# EAGLE design IRAMX-drv-v3.1 (EAGLE 7.2.0)
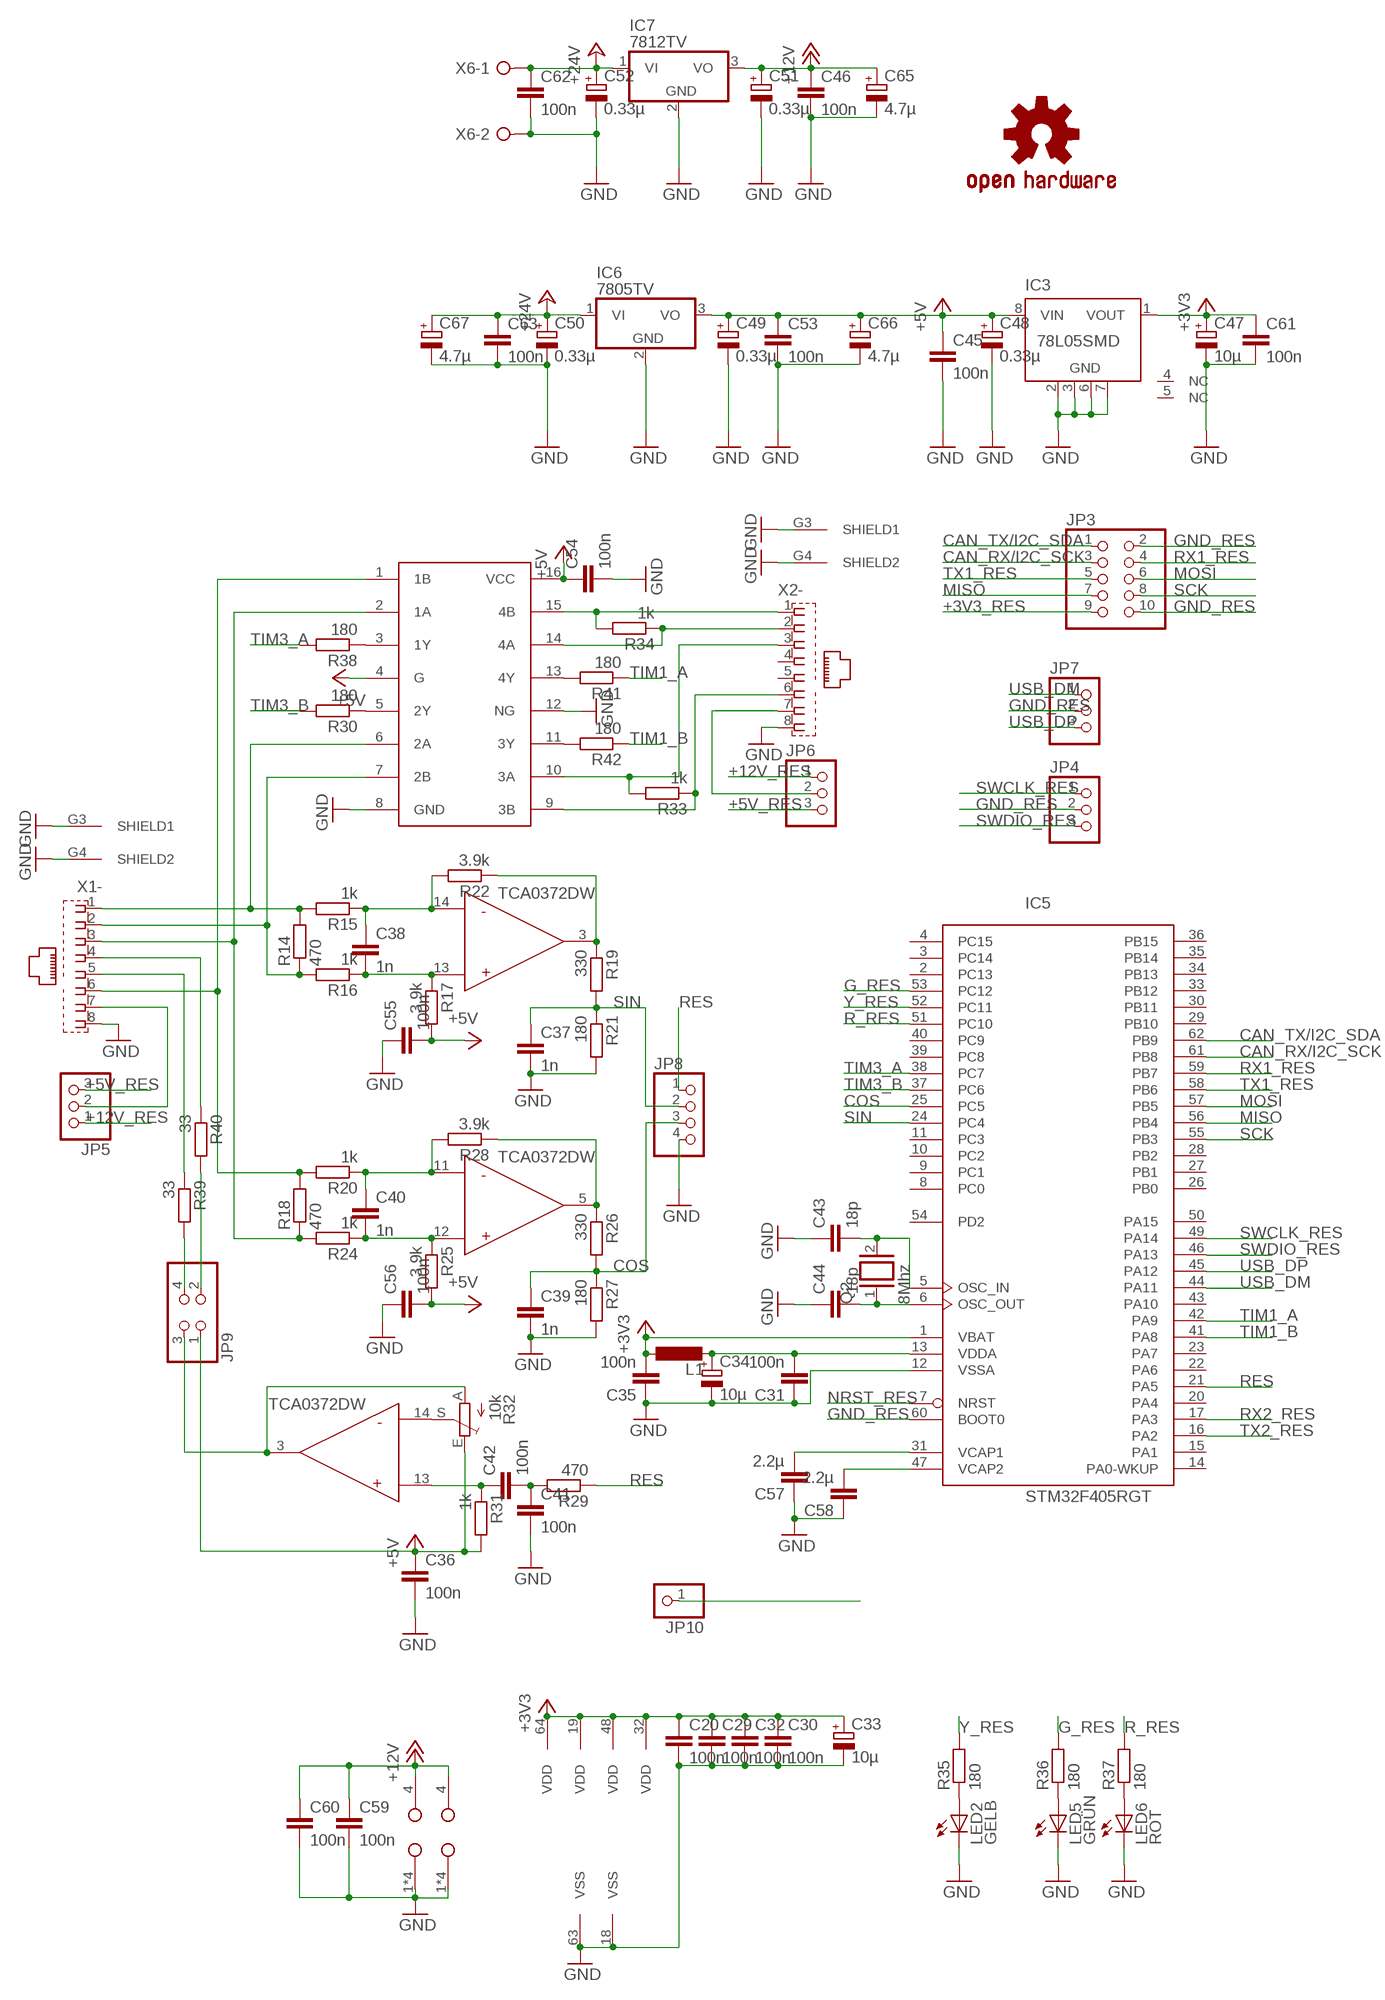
[diagram p0: schematic, sheet 1, part 1 of 2]
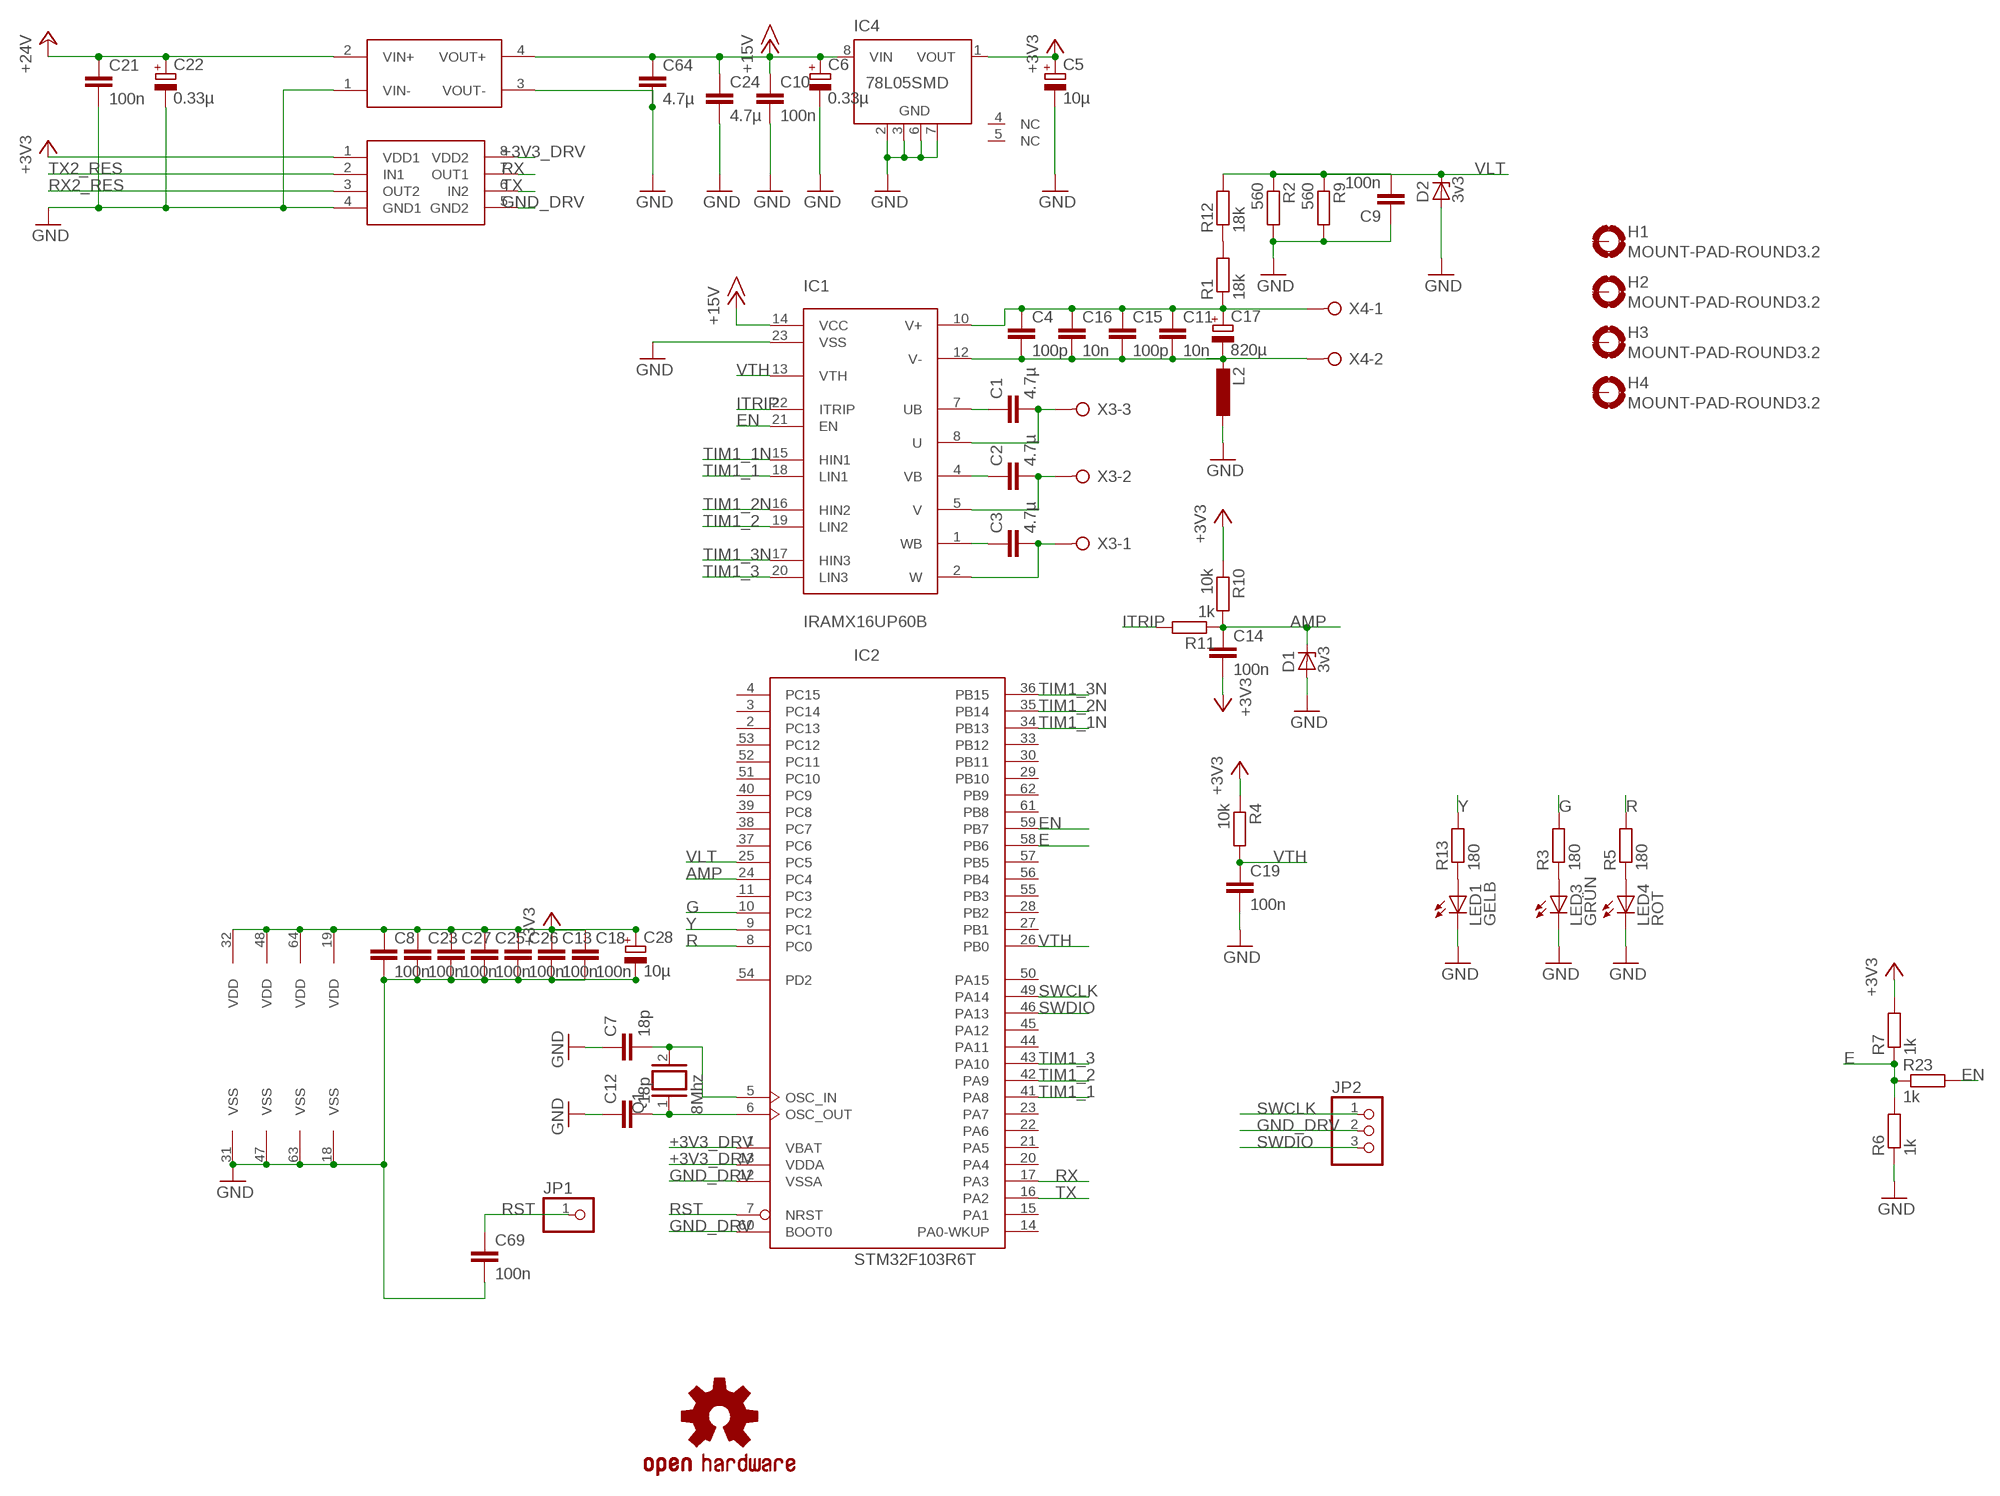
[diagram p1: schematic, sheet 1, part 2 of 2]

## Parts
C1  4.7µ  C-EUC0805K  [C0805K]
C2  4.7µ  C-EUC0805K  [C0805K]
C3  4.7µ  C-EUC0805K  [C0805K]
C4  100p  C-EUC1206K  [C1206K]
C5  10µ  CPOL-EUA/3216-18R  [A/3216-18R]
C6  0.33µ  CPOL-EUA/3216-18R  [A/3216-18R]
C7  18p  C-EUC0805  [C0805]
C8  100n  C-EUC0805K  [C0805K]
C9  100n  C-EUC0805K  [C0805K]
C10  100n  C-EUC0805K  [C0805K]
C11  10n  C-EUC0805K  [C0805K]
C12  18p  C-EUC0805  [C0805]
C13  100n  C-EUC0805K  [C0805K]
C14  100n  C-EUC0805K  [C0805K]
C15  100p  C-EUC1206K  [C1206K]
C16  10n  C-EUC0805K  [C0805K]
C17  820µ  CPOL-EUE10-35  [EB35D]
C18  100n  C-EUC0805K  [C0805K]
C19  100n  C-EUC0805K  [C0805K]
C20  100n  C-EUC0805K  [C0805K]
C21  100n  C-EUC0805K  [C0805K]
C22  0.33µ  CPOL-EUA/3216-18R  [A/3216-18R]
C23  100n  C-EUC0805K  [C0805K]
C24  4.7µ  C-EUC0805K  [C0805K]
C25  100n  C-EUC0805K  [C0805K]
C26  100n  C-EUC0805K  [C0805K]
C27  100n  C-EUC0805K  [C0805K]
C28  10µ  CPOL-EUA/3216-18R  [A/3216-18R]
C29  100n  C-EUC0805K  [C0805K]
C30  100n  C-EUC0805K  [C0805K]
C31  100n  C-EUC0805K  [C0805K]
C32  100n  C-EUC0805K  [C0805K]
C33  10µ  CPOL-EUA/3216-18R  [A/3216-18R]
C34  10µ  CPOL-EUA/3216-18R  [A/3216-18R]
C35  100n  C-EUC0805K  [C0805K]
C36  100n  C-EUC0805K  [C0805K]
C37  1n  C-EUC0805K  [C0805K]
C38  1n  C-EUC0805K  [C0805K]
C39  1n  C-EUC0805K  [C0805K]
C40  1n  C-EUC0805K  [C0805K]
C41  100n  C-EUC0805K  [C0805K]
C42  100n  C-EUC0805K  [C0805K]
C43  18p  C-EUC0805  [C0805]
C44  18p  C-EUC0805  [C0805]
C45  100n  C-EUC0805K  [C0805K]
C46  100n  C-EUC0805K  [C0805K]
C47  10µ  CPOL-EUA/3216-18R  [A/3216-18R]
C48  0.33µ  CPOL-EUA/3216-18R  [A/3216-18R]
C49  0.33µ  CPOL-EUA/3216-18R  [A/3216-18R]
C50  0.33µ  CPOL-EUA/3216-18R  [A/3216-18R]
C51  0.33µ  CPOL-EUA/3216-18R  [A/3216-18R]
C52  0.33µ  CPOL-EUA/3216-18R  [A/3216-18R]
C53  100n  C-EUC0805K  [C0805K]
C54  100n  C-EUC0805K  [C0805K]
C55  100n  C-EUC0805K  [C0805K]
C56  100n  C-EUC0805K  [C0805K]
C57  2.2µ  C-EUC0805K  [C0805K]
C58  2.2µ  C-EUC0805K  [C0805K]
C59  100n  C-EUC0805K  [C0805K]
C60  100n  C-EUC0805K  [C0805K]
C61  100n  C-EUC0805K  [C0805K]
C62  100n  C-EUC0805K  [C0805K]
C63  100n  C-EUC0805K  [C0805K]
C64  4.7µ  C-EUC0805K  [C0805K]
C65  4.7µ  CPOL-EUE2.5-6  [E2,5-6]
C66  4.7µ  CPOL-EUE2.5-6  [E2,5-6]
C67  4.7µ  CPOL-EUE2.5-6  [E2,5-6]
C69  100n  C-EUC0805K  [C0805K]
D1  3v3  ZENER-DIODESOD80C  [SOD80C]
D2  3v3  ZENER-DIODESOD80C  [SOD80C]
H1  MOUNT-PAD-ROUND3.2  [3,2-PAD]
H2  MOUNT-PAD-ROUND3.2  [3,2-PAD]
H3  MOUNT-PAD-ROUND3.2  [3,2-PAD]
H4  MOUNT-PAD-ROUND3.2  [3,2-PAD]
IC1  IRAMX16UP60B  IRAMTOP  [SIP23_TOP]
IC2  STM32F103R6T  [LQFP64]
IC3  78L05SMD  [SO08]
IC4  78L05SMD  [SO08]
IC5  STM32F405RGT  [LQFP64]
IC6  7805TV  [TO220V]
IC7  7812TV  [TO220V]
JP1  PINHD-1X1  [1X01]
JP2  PINHD-1X3  [1X03]
JP3  PINHD-2X5  [2X05]
JP4  PINHD-1X3  [1X03]
JP5  PINHD-1X3  [1X03]
JP6  PINHD-1X3  [1X03]
JP7  PINHD-1X3  [1X03]
JP8  PINHD-1X4  [1X04]
JP9  PINHD-2X2  [2X02]
JP10  PINHD-1X1  [1X01]
L1  L-EUL2825P  [L2825P]
L2  L-EUL2825P  [L2825P]
LED1  GELB  LED3MM  [LED3MM]
LED2  GELB  LED3MM  [LED3MM]
LED3  GRÜN  LED3MM  [LED3MM]
LED4  ROT  LED3MM  [LED3MM]
LED5  GRÜN  LED3MM  [LED3MM]
LED6  ROT  LED3MM  [LED3MM]
LOGO1  OSHW-LOGOL  [OSHW-LOGO-L]
LOGO2  OSHW-LOGOL  [OSHW-LOGO-L]
Q1  8Mhz  XTAL/S  [QS]
Q2  8Mhz  XTAL/S  [QS]
R1  18k  R-EU_  [CER]
R2  560  R-EU_R0805  [R0805]
R3  180  R-EU_R0805  [R0805]
R4  10k  R-EU_R0805  [R0805]
R5  180  R-EU_R0805  [R0805]
R6  1k  R-EU_R0805  [R0805]
R7  1k  R-EU_R0805  [R0805]
R9  560  R-EU_R0805  [R0805]
R10  10k  R-EU_R0805  [R0805]
R11  1k  R-EU_R0805  [R0805]
R12  18k  R-EU_  [CER]
R13  180  R-EU_R0805  [R0805]
R14  470  R-EU_R0805  [R0805]
R15  1k  R-EU_R0805  [R0805]
R16  1k  R-EU_R0805  [R0805]
R17  3.9k  R-EU_R0805  [R0805]
R18  470  R-EU_R0805  [R0805]
R19  330  R-EU_R0805  [R0805]
R20  1k  R-EU_R0805  [R0805]
R21  180  R-EU_R0805  [R0805]
R22  3.9k  R-EU_R0805  [R0805]
R23  1k  R-EU_R0805  [R0805]
R24  1k  R-EU_R0805  [R0805]
R25  3.9k  R-EU_R0805  [R0805]
R26  330  R-EU_R0805  [R0805]
R27  180  R-EU_R0805  [R0805]
R28  3.9k  R-EU_R0805  [R0805]
R29  470  R-EU_R0805  [R0805]
R30  180  R-EU_R0805  [R0805]
R31  1k  R-EU_R0805  [R0805]
R32  10k  TRIM_EU-CA6V  [CA6V]
R33  1k  R-EU_R0805  [R0805]
R34  1k  R-EU_R0805  [R0805]
R35  180  R-EU_R0805  [R0805]
R36  180  R-EU_R0805  [R0805]
R37  180  R-EU_R0805  [R0805]
R38  180  R-EU_R0805  [R0805]
R39  33  R-EU_R0805  [R0805]
R40  33  R-EU_R0805  [R0805]
R41  180  R-EU_R0805  [R0805]
R42  180  R-EU_R0805  [R0805]
U$1  SI8621  [SOIC08]
U$2  RO-XXXX  [SIP4]
U$3  TCA0372DWDM2  [TCA0372DM2]
U$4  TCA0372DWDM2  [TCA0372DM2]
U$5  AM26LS32ACD  [SO16]
X1  RJ45  [RJ45]
X2  RJ45  [RJ45]
X3  W237-03P  [W237-133]
X4  W237-02P  [W237-132]
X6  W237-02P  [W237-132]

## Nets
+3V3_DRV: C5.+ C8.1 C13.1 C14.2 C18.1 C23.1 C25.1 C26.1 C27.1 C28.+ IC2.1(VBAT) IC2.13(VDDA) IC2.19(VDD) IC2.32(VDD) IC2.48(VDD) IC2.64(VDD) IC4.1(VOUT) R4.1 R7.2 R10.1 U$1.8(VDD2) ; supply symbol labelled +3V3
+3V3_RES: C20.1 C29.1 C30.1 C32.1 C33.+ C35.2 C47.+ C61.1 IC3.1(VOUT) IC5.1(VBAT) IC5.19(VDD) IC5.32(VDD) IC5.48(VDD) IC5.64(VDD) JP3.9 L1.1 U$1.1(VDD1) ; supply symbol labelled +3V3
+5V_RES: C36.1 C45.1 C48.+ C49.+ C53.1 C54.1 C55.2 C56.2 C66.+ IC3.8(VIN) IC6.3(VO) JP5.3 JP6.3 JP9.1 R17.2 R25.2 R31.2 R32.E U$5.4(G) U$5.16(VCC) ; supply symbol labelled +5V
+12V_RES: C46.1 C51.+ C59.1 C60.1 C65.+ IC7.3(VO) JP5.1 JP6.1 U$3.4(VCC) U$4.4(VCC) ; supply symbol labelled +12V
+15V_DRV: C6.+ C10.1 C24.1 C64.1 IC1.14(VCC) IC4.8(VIN) U$2.4(VOUT+) ; supply symbol labelled +15V
+24V_RES: C21.1 C22.+ C50.+ C52.+ C62.1 C63.1 C67.+ IC6.1(VI) IC7.1(VI) U$2.2(VIN+) X6.1 ; supply symbol labelled +24V
AMP: C14.1 D1.C IC2.24(PC4) R10.2 R11.1
CAN_RX/I2C_SCK: IC5.61(PB8) JP3.3
CAN_TX/I2C_SDA: IC5.62(PB9) JP3.1
COS: C39.1 IC5.25(PC5) JP8.3 R26.2 R27.1
E: IC2.58(PB6) R6.2 R7.1 R23.1
EN: IC1.21(EN) IC2.59(PB7) R23.2
G: IC2.10(PC2) R3.2
G_RES: IC5.53(PC12) R36.2
GND_DRV: C5.- C6.- C7.1 C8.2 C9.1 C10.2 C12.1 C13.2 C18.2 C19.2 C23.2 C24.2 C25.2 C26.2 C27.2 C28.- C64.2 C69.2 D1.A D2.A IC1.23(VSS) IC2.12(VSSA) IC2.18(VSS) IC2.31(VSS) IC2.47(VSS) IC2.60(BOOT0) IC2.63(VSS) IC4.2(GND) IC4.3(GND) IC4.6(GND) IC4.7(GND) JP2.2 L2.1 LED1.K(C) LED3.K(C) LED4.K(C) R2.2 R6.1 R9.2 U$1.5(GND2) U$2.3(VOUT-) ; supply symbol labelled GND
GND_RES: C20.2 C21.2 C22.- C29.2 C30.2 C31.1 C32.2 C33.- C34.- C35.1 C36.2 C37.2 C39.2 C41.2 C43.1 C44.1 C45.2 C46.2 C47.- C48.- C49.- C50.- C51.- C52.- C53.2 C54.2 C55.1 C56.1 C57.1 C58.1 C59.2 C60.2 C61.2 C62.2 C63.2 C65.- C66.- C67.- IC3.2(GND) IC3.3(GND) IC3.6(GND) IC3.7(GND) IC5.12(VSSA) IC5.18(VSS) IC5.60(BOOT0) IC5.63(VSS) IC6.2(GND) IC7.2(GND) JP3.2 JP3.10 JP4.2 JP7.2 JP8.4 LED2.K(C) LED5.K(C) LED6.K(C) R21.2 R27.2 U$1.4(GND1) U$2.1(VIN-) U$3.1(GND) U$3.8(GND) U$3.9(GND) U$3.16(GND) U$4.1(GND) U$4.8(GND) U$4.9(GND) U$4.16(GND) U$5.8(GND) U$5.12(NG) X1.8 X1.G3(SHIELD1) X1.G4(SHIELD2) X2.8 X2.G3(SHIELD1) X2.G4(SHIELD2) X6.2 ; supply symbol labelled GND
ITRIP: IC1.22(ITRIP) R11.2
MISO: IC5.56(PB4) JP3.7
MOSI: IC5.57(PB5) JP3.6
N$1 [iso]: C1.1 IC1.7(UB)
N$2 [iso]: R1.P$2 R12.P$1
N$3 [iso]: C2.1 IC1.4(VB)
N$4: LED2.A R35.1
N$5 [iso]: C3.1 IC1.1(WB)
N$6: R32.S U$4.14(IN-)
N$8: LED3.A R3.1
N$9: LED4.A R5.1
N$10: C7.2 IC2.5(OSC_IN) Q1.2
N$11: LED5.A R36.1
N$12: C12.2 IC2.6(OSC_OUT) Q1.1
N$13: C58.2 IC5.47(VCAP2)
N$14: C57.2 IC5.31(VCAP1)
N$15: C44.2 IC5.6(OSC_OUT) Q2.1
N$16: JP5.2 X1.7
N$17: JP9.4 R39.2
N$18: R19.1 R22.1 U$3.3(OUT)
N$19: C38.2 R16.1 R17.1 U$3.13(IN+)
N$20: LED6.A R37.1
N$21: JP9.2 R40.2
N$24: C40.2 R24.1 R25.1 U$3.12(IN+)
N$25: JP6.2 X2.7
N$26: R26.1 R28.1 U$3.5(OUT)
N$27: R40.1 X1.4
N$28: C40.1 R20.1 R28.2 U$3.11(IN-)
N$29: R34.2 U$5.15(4B) X2.1
N$30: C41.1 C42.2 R29.2
N$31: C42.1 R31.1 U$4.13(IN+)
N$32: C38.1 R15.1 R22.2 U$3.14(IN-)
N$33: JP9.3 R32.A U$4.3(OUT)
N$34: R39.1 X1.5
N$35: R30.1 U$5.5(2Y)
N$36: R34.1 U$5.14(4A) X2.2
N$37: R33.2 U$5.10(3A) X2.3
N$38: R33.1 U$5.9(3B) X2.6
N$39: C43.2 IC5.5(OSC_IN) Q2.2
N$40: R18.2 R20.2 U$5.1(1B) X1.6
N$41: R14.1 R16.2 U$5.7(2B) X1.2
N$42: R42.2 U$5.11(3Y)
N$43: LED1.A R13.1
N$44: R41.2 U$5.13(4Y)
N$45: R38.1 U$5.3(1Y)
N$46: C31.2 C34.+ IC5.13(VDDA) L1.2
N$47: R14.2 R15.2 U$5.6(2A) X1.1
N$50: R18.1 R24.2 U$5.2(1A) X1.3
NRST_RES: IC5.7(NRST) JP10.1
R: IC2.8(PC0) R5.2
R_RES: IC5.51(PC10) R37.2
RES: IC5.21(PA5) JP8.1 R29.1
RST: C69.1 IC2.7(NRST) JP1.1
RX: IC2.17(PA3) U$1.7(OUT1)
RX1_RES: IC5.59(PB7) JP3.4
RX2_RES: IC5.17(PA3) U$1.3(OUT2)
SCK: IC5.55(PB3) JP3.8
SIN: C37.1 IC5.24(PC4) JP8.2 R19.2 R21.1
SWCLK: IC2.49(PA14) JP2.1
SWCLK_RES: IC5.49(PA14) JP4.1
SWDIO: IC2.46(PA13) JP2.3
SWDIO_RES: IC5.46(PA13) JP4.3
TIM1_1: IC1.18(LIN1) IC2.41(PA8)
TIM1_1N: IC1.15(HIN1) IC2.34(PB13)
TIM1_2: IC1.19(LIN2) IC2.42(PA9)
TIM1_2N: IC1.16(HIN2) IC2.35(PB14)
TIM1_3: IC1.20(LIN3) IC2.43(PA10)
TIM1_3N: IC1.17(HIN3) IC2.36(PB15)
TIM1_A: IC5.42(PA9) R41.1
TIM1_B: IC5.41(PA8) R42.1
TIM3_A: IC5.38(PC7) R38.2
TIM3_B: IC5.37(PC6) R30.2
TX: IC2.16(PA2) U$1.6(IN2)
TX1_RES: IC5.58(PB6) JP3.5
TX2_RES: IC5.16(PA2) U$1.2(IN1)
U [dick]: C1.2 IC1.8(U) X3.3
USB_DM: IC5.44(PA11) JP7.1
USB_DP: IC5.45(PA12) JP7.3
V [dick]: C2.2 IC1.5(V) X3.2
V+ [dick]: C4.1 C11.1 C15.1 C16.1 C17.+ IC1.10(V+) R1.P$1 X4.1
V- [iso]: C4.2 C11.2 C15.2 C16.2 C17.- IC1.12(V-) L2.2 X4.2
VLT: C9.2 D2.C IC2.25(PC5) R2.1 R9.1 R12.P$2
VTH: C19.1 IC1.13(VTH) IC2.26(PB0) R4.2
W [dick]: C3.2 IC1.2(W) X3.1
Y: IC2.9(PC1) R13.2
Y_RES: IC5.52(PC11) R35.2
Unconnected: H1.B3,2(MOUNT) H2.B3,2(MOUNT) H3.B3,2(MOUNT) H4.B3,2(MOUNT) IC2.2(PC13) IC2.3(PC14) IC2.4(PC15) IC2.11(PC3) IC2.14(PA0-WKUP) IC2.15(PA1) IC2.20(PA4) IC2.21(PA5) IC2.22(PA6) IC2.23(PA7) IC2.27(PB1) IC2.28(PB2) IC2.29(PB10) IC2.30(PB11) IC2.33(PB12) IC2.37(PC6) IC2.38(PC7) IC2.39(PC8) IC2.40(PC9) IC2.44(PA11) IC2.45(PA12) IC2.50(PA15) IC2.51(PC10) IC2.52(PC11) IC2.53(PC12) IC2.54(PD2) IC2.55(PB3) IC2.56(PB4) IC2.57(PB5) IC2.61(PB8) IC2.62(PB9) IC3.4(NC) IC3.5(NC) IC4.4(NC) IC4.5(NC) IC5.2(PC13) IC5.3(PC14) IC5.4(PC15) IC5.8(PC0) IC5.9(PC1) IC5.10(PC2) IC5.11(PC3) IC5.14(PA0-WKUP) IC5.15(PA1) IC5.20(PA4) IC5.22(PA6) IC5.23(PA7) IC5.26(PB0) IC5.27(PB1) IC5.28(PB2) IC5.29(PB10) IC5.30(PB11) IC5.33(PB12) IC5.34(PB13) IC5.35(PB14) IC5.36(PB15) IC5.39(PC8) IC5.40(PC9) IC5.43(PA10) IC5.50(PA15) IC5.54(PD2) U$4.5(OUT) U$4.11(IN-) U$4.12(IN+) X2.4 X2.5

## Library data of the parts
C1-C4 C7-C16 C18-C21 C23-C27 C29-C32 C35-C46 C53-C64 C69 = rcl:C-EU: CAPACITOR, European symbol
C5 C6 C17 C22 C28 C33 C34 C47-C52 C65-C67 = rcl:CPOL-EU: POLARIZED CAPACITOR, European symbol
D1 D2 = diode:ZENER-DIODE: Z-Diode
H1-H4 = holes:MOUNT-PAD-ROUND: MOUNTING PAD, round
IC1 = iram-b:IRAM
IC2 = micro-stm_v2:STM32F103R*T: ARM 32-bit Cortex™-M3 CPU 72 MHz maximum frequency 16 to 1024 Kbytes of Flash memory 6 to 96 kbytes of SRAM 51 GPIOs 2.0 to 3.6 V application supply
IC3 IC4 = linear:78L*SMD: Positive VOLTAGE REGULATOR
IC5 = micro-stm_v2:STM32F405R*T: ARM 32-bit Cortex™-M3 CPU 168 MHz maximum frequency 1024 Kbytes of Flash memory 192 kbytes of SRAM 51 GPIOs 1.8 to 3.6 V application supply
IC6 IC7 = linear:78*: Positive VOLTAGE REGULATOR Source: http://cache.national.com/ds/LM/LM78L05.pdf http://www.fairchildsemi.com/ds/LM/LM7805.pdf
JP1 JP10 = pinhead:PINHD-1X1: PIN HEADER
JP2 JP4-JP7 = pinhead:PINHD-1X3: PIN HEADER
JP3 = pinhead:PINHD-2X5: PIN HEADER
JP8 = pinhead:PINHD-1X4: PIN HEADER
JP9 = pinhead:PINHD-2X2: PIN HEADER
L1 L2 = resistor:L-EU: INDUCTOR, European symbol
LED1-LED6 = led:LED: LED OSRAM: - CHIPLED LG R971, LG N971, LY N971, LG Q971, LY Q971, LO R971, LY R971 LH N974, LH R974 LS Q976, LO Q976, LY Q976 LO Q996 - Hyper CHIPLED LW Q18S LB Q993, LB Q99A, LB R99A - SideLED LS A670, LO A670, LY A670, LG A670, LP A670 LB A673, LV A673, LT A673, LW A673 LH A674 LY A675 LS A676, LA A676, LO A676, LY A676, LW A676 LS A679, LY A679, LG A679 - Hyper Micro SIDELED® LS Y876, LA Y876, LO Y876, LY Y876 LT Y87S - SmartLED LW L88C, LW L88S LB L89C, LB L89S, LG L890 LS L89K, LO L89K, LY L89K LS L896, LA L896, LO L896, LY L896 - TOPLED LS T670, LO T670, LY T670, LG T670, LP T670 LSG T670, LSP T670, LSY T670, LOP T670, LYG T670 LG T671, LOG T671, LSG T671 LB T673, LV T673, LT T673, LW T673 LH T674 LS T676, LA T676, LO T676, LY T676, LB T676, LH T676, LSB T676, LW T676 LB T67C, LV T67C, LT T67C, LS T67K, LO T67K, LY T67K, LW E67C LS E67B, LA E67B, LO E67B, LY E67B, LB E67C, LV E67C, LT E67C LW T67C LS T679, LY T679, LG T679 LS T770, LO T770, LY T770, LG T770, LP T770 LB T773, LV T773, LT T773, LW T773 LH T774 LS E675, LA E675, LY E675, LS T675 LS T776, LA T776, LO T776, LY T776, LB T776 LHGB T686 LT T68C, LB T68C - Hyper Mini TOPLED® LB M676 - Mini TOPLED Santana® LG M470 LS M47K, LO M47K, LY M47K Source: http://www.osram.convergy.de LUXEON: - LUMILED® LXK2-PW12-R00, LXK2-PW12-S00, LXK2-PW14-U00, LXK2-PW14-V00 LXK2-PM12-R00, LXK2-PM12-S00, LXK2-PM14-U00 LXK2-PE12-Q00, LXK2-PE12-R00, LXK2-PE12-S00, LXK2-PE14-T00, LXK2-PE14-U00 LXK2-PB12-K00, LXK2-PB12-L00, LXK2-PB12-M00, LXK2-PB14-N00, LXK2-PB14-P00, LXK2-PB14-Q00 LXK2-PR12-L00, LXK2-PR12-M00, LXK2-PR14-Q00, LXK2-PR14-R00 LXK2-PD12-Q00, LXK2-PD12-R00, LXK2-PD12-S00 LXK2-PH12-R00, LXK2-PH12-S00 LXK2-PL12-P00, LXK2-PL12-Q00, LXK2-PL12-R00 Source: www.luxeon.com KINGBRIGHT: KA-3528ASYC Source: www.kingbright.com
LOGO1 LOGO2 = wz:OSHW-LOGO: Open Source Hardware Logo This logo indicates the piece of hardware it is found on incorporates a OSHW license and/or adheres to the definition of open source hardware found here: http://freedomdefined.org/OSHW
Q1 Q2 = special:XTAL/S: CRYSTAL
R1 R12 = reroolib:R-EU_: RESISTOR, European symbol
R2-R7 R9-R11 R13-R31 R33-R42 = rcl:R-EU_: RESISTOR, European symbol
R32 = pot:TRIM_EU-: POTENTIOMETER
U$1 = reroolib:SI8621
U$2 = reroolib:RO-XXXX
U$3 U$4 = tca0372dw:TCA0372DW
U$5 = reroolib:AM26LS32
X1 X2 = reroolib:RJ45: AMP connector
X3 = con-wago-508:W237-03P: WAGO SREW CLAMP; OC_FARNELL: unknown; OC_NEWARK: unknown
X4 X6 = con-wago-508:W237-02P: WAGO SREW CLAMP; OC_FARNELL: unknown; OC_NEWARK: unknown

## Net classes
0 default: width 0.3 mm, clearance 0.19 mm
1 dick: width 3.5 mm, clearance 1 mm
2 iso: width 0.5 mm, clearance 1 mm

## Board
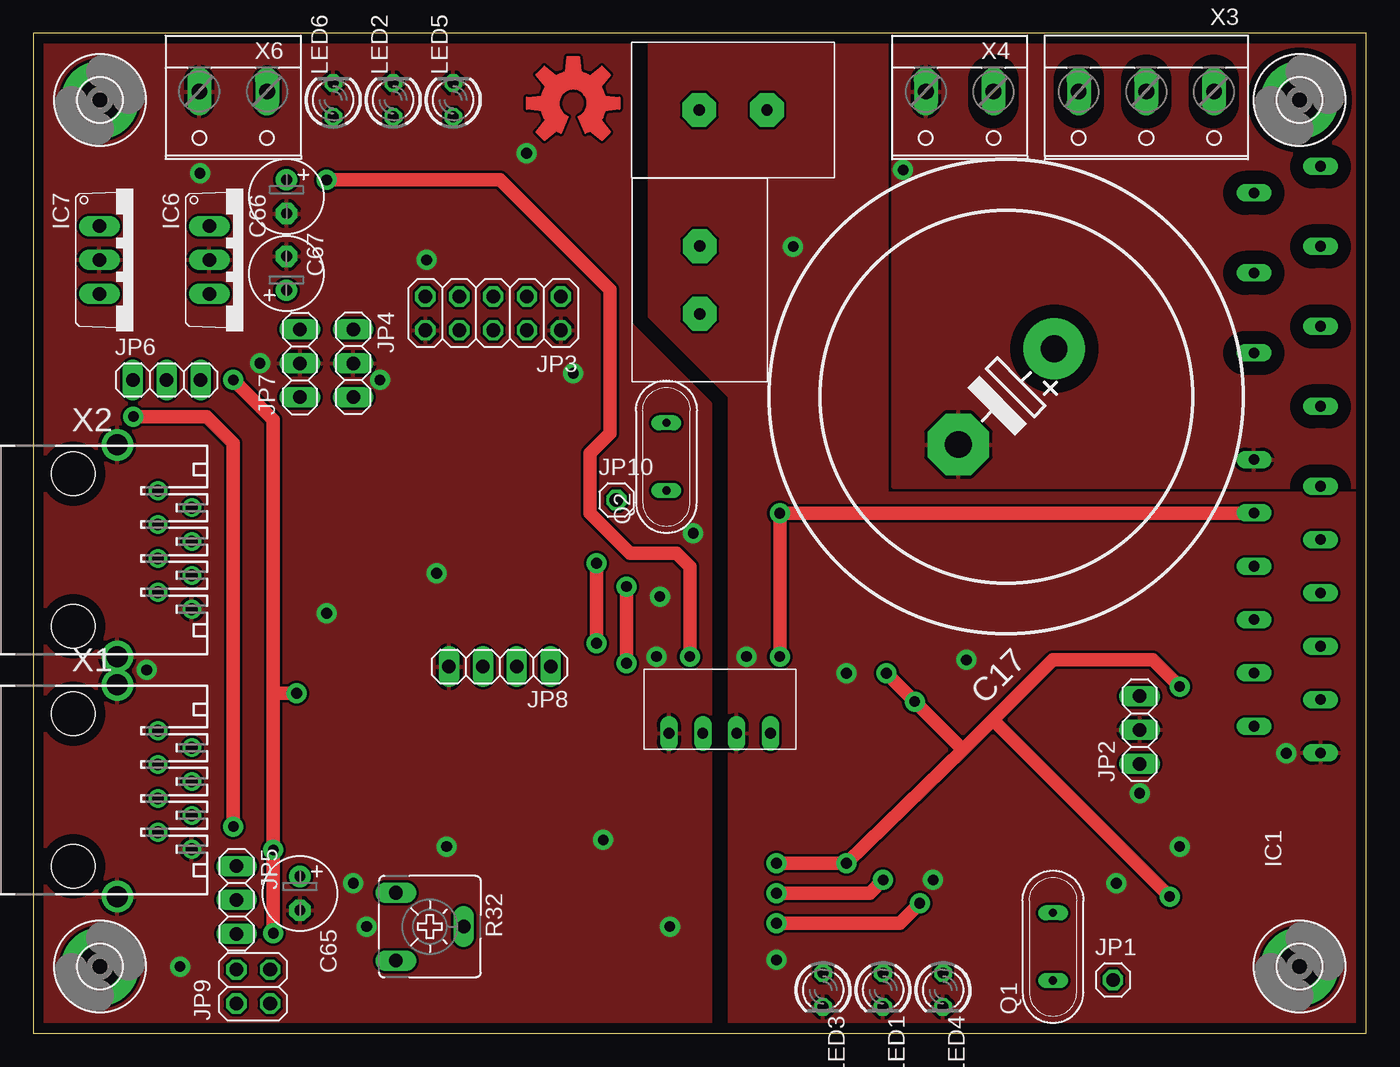
[diagram p2: board, top side]
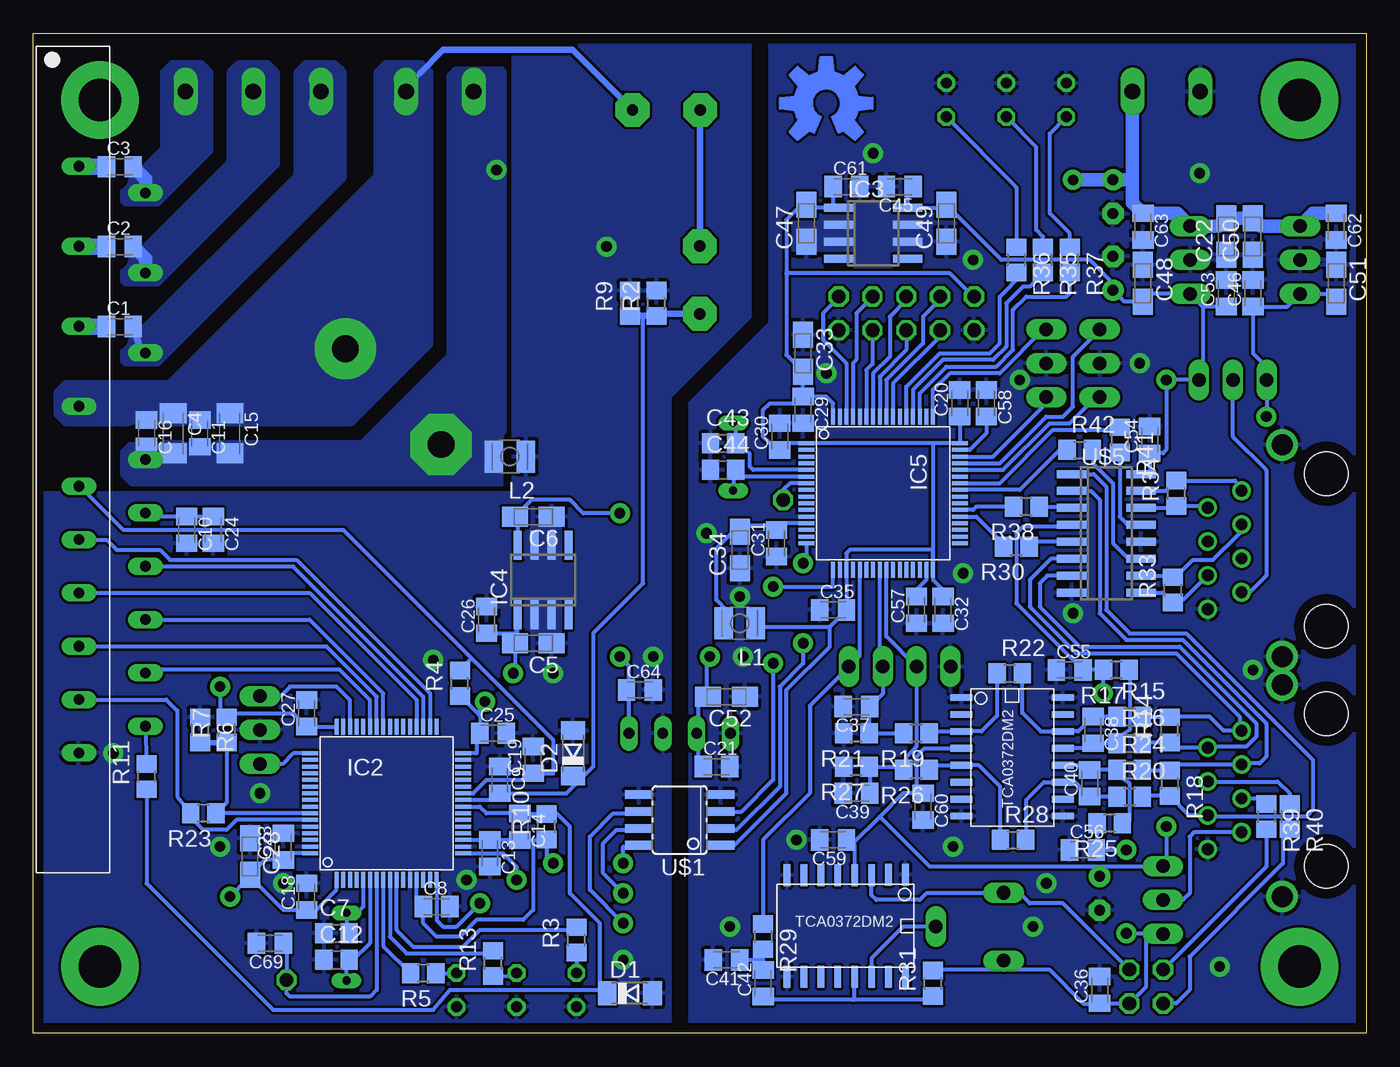
[diagram p3: board, bottom side, seen from below]

Size 100 x 75 mm. Coordinates in mm from the lower left corner, seen from the top.
Outline: 0,0 100,0 100,75 0,75 0,0
Copper layers (1*16): Top 0.035mm / dielectric 1.5mm / Bottom 0.035mm
Design rules "cnc *": minimum track width 10mil, minimum drill 0.1mm, track to track 7mil, track to pad 7mil, pad to pad 7mil, via to via 7mil, smd to smd 7mil, copper to edge 30mil, drill to drill 8mil, minimum pad ring 10mil, minimum via ring 8mil, stop-mask expansion 4mil, vias tented up to drill 0mil, thermal gap 10mil

### Footprints (pad centres in the part's own frame; a part is rotated, then mirrored left to right if it is on the bottom)
C0805K = smd 1.3 x 1.6: 1 -1,0; 2 1,0
C1206K = smd 1.5 x 2: 1 -1.5,0; 2 1.5,0
A/3216-18R = smd 1.95 x 1.5: + 1.375,0; - -1.375,0
C0805 = smd 1.3 x 1.5: 1 -0.95,0; 2 0.95,0
EB35D = drill 2.007 pad 4.597: + -5.08,0 | drill 2.007 pad 4.597 octagon: - 5.08,0
E2,5-6 = drill 0.813 pad 1.6: + -1.27,0 | drill 0.813 pad 1.6 octagon: - 1.27,0
SOD80C = smd 1.4 x 1.8: A 1.7,0; C -1.7,0
3,2-PAD = drill 3.2 pad 5.842: B3,2 0,0
SIP23_TOP = drill 0.8 long: 1 2.03,-5.08; 2 0.03,-0.08; 4 -3.97,-5.08; 5 -5.97,-0.08; 7 -9.97,-5.08; 8 -11.97,-0.08; 10 -15.97,-5.08; 12 -19.97,-0.08; 13 -21.97,-5.08; 14 -23.97,-0.08; 15 -25.97,-5.08; 16 -27.97,-0.08; 17 -29.97,-5.08; 18 -31.97,-0.08; 19 -33.97,-5.08; 20 -35.97,-0.08; 21 -37.97,-5.08; 22 -39.97,-0.08; 23 -41.97,-5.08
LQFP64 = smd 0.3 x 1.2: 1 -3.75,-5.75; 2 -3.25,-5.75; 3 -2.75,-5.75; 4 -2.25,-5.75; 5 -1.75,-5.75; 6 -1.25,-5.75; 7 -0.75,-5.75; 8 -0.25,-5.75; 9 0.25,-5.75; 10 0.75,-5.75; 11 1.25,-5.75; 12 1.75,-5.75; 13 2.25,-5.75; 14 2.75,-5.75; 15 3.25,-5.75; 16 3.75,-5.75; 33 3.75,5.75; 34 3.25,5.75; 35 2.75,5.75; 36 2.25,5.75; 37 1.75,5.75; 38 1.25,5.75; 39 0.75,5.75; 40 0.25,5.75; 41 -0.25,5.75; 42 -0.75,5.75; 43 -1.25,5.75; 44 -1.75,5.75; 45 -2.25,5.75; 46 -2.75,5.75; 47 -3.25,5.75; 48 -3.75,5.75 | smd 1.2 x 0.3: 17 5.75,-3.75; 18 5.75,-3.25; 19 5.75,-2.75; 20 5.75,-2.25; 21 5.75,-1.75; 22 5.75,-1.25; 23 5.75,-0.75; 24 5.75,-0.25; 25 5.75,0.25; 26 5.75,0.75; 27 5.75,1.25; 28 5.75,1.75; 29 5.75,2.25; 30 5.75,2.75; 31 5.75,3.25; 32 5.75,3.75; 49 -5.75,3.75; 50 -5.75,3.25; 51 -5.75,2.75; 52 -5.75,2.25; 53 -5.75,1.75; 54 -5.75,1.25; 55 -5.75,0.75; 56 -5.75,0.25; 57 -5.75,-0.25; 58 -5.75,-0.75; 59 -5.75,-1.25; 60 -5.75,-1.75; 61 -5.75,-2.25; 62 -5.75,-2.75; 63 -5.75,-3.25; 64 -5.75,-3.75
SO08 = smd 0.6 x 2.2: 1 -1.905,-2.6; 2 -0.635,-2.6; 3 0.635,-2.6; 4 1.905,-2.6; 5 1.905,2.6; 6 0.635,2.6; 7 -0.635,2.6; 8 -1.905,2.6
TO220V = drill 1.016 long: 1 -2.54,-2.54; 2 0,-2.54; 3 2.54,-2.54
1X01 = drill 1.016 octagon: 1 0,0
1X03 = drill 1.016 long: 1 -2.54,0; 2 0,0; 3 2.54,0
2X05 = drill 1.016 octagon: 1 -5.08,-1.27; 2 -5.08,1.27; 3 -2.54,-1.27; 4 -2.54,1.27; 5 0,-1.27; 6 0,1.27; 7 2.54,-1.27; 8 2.54,1.27; 9 5.08,-1.27; 10 5.08,1.27
1X04 = drill 1.016 long: 1 -3.81,0; 2 -1.27,0; 3 1.27,0; 4 3.81,0
2X02 = drill 1.016 octagon: 1 -1.27,-1.27; 2 -1.27,1.27; 3 1.27,-1.27; 4 1.27,1.27
L2825P = smd 1.4 x 2.4: 1 -1.2,0; 2 1.2,0
LED3MM = drill 0.813 octagon: A -1.27,0; K 1.27,0
QS = drill 0.61 long: 1 -2.54,0; 2 2.54,0
CER = drill 0.85 pad 2.54 octagon: P$1 -2.54,0; P$2 2.54,0
R0805 = smd 1.3 x 1.5: 1 -0.95,0; 2 0.95,0
CA6V = drill 1.016 long: A -2.54,-2.54; E 2.54,-2.54; S 0,2.54
SOIC08 = smd 0.66 x 2.032: 1 -1.905,-3.073; 2 -0.635,-3.073; 3 0.635,-3.073; 4 1.905,-3.073; 5 1.905,3.073; 6 0.635,3.073; 7 -0.635,3.073; 8 -1.905,3.073
SIP4 = drill 0.8 long: 1 3.81,0; 2 1.27,0; 3 -1.27,0; 4 -3.81,0
TCA0372DM2 = smd 0.508 x 1.651: 1 -4.434,-3.878; 2 -3.163,-3.878; 3 -1.893,-3.868; 4 -0.624,-3.868; 5 0.646,-3.868; 6 1.917,-3.868; 7 3.187,-3.868; 8 4.457,-3.868; 9 4.457,3.748; 10 3.187,3.748; 11 1.917,3.748; 12 0.646,3.748; 13 -0.624,3.748; 14 -1.893,3.748; 15 -3.163,3.748; 16 -4.434,3.748
SO16 = smd 0.6 x 2.2: 1 -4.445,-2.6; 2 -3.175,-2.6; 3 -1.905,-2.6; 4 -0.635,-2.6; 5 0.635,-2.6; 6 1.905,-2.6; 7 3.175,-2.6; 8 4.445,-2.6; 9 4.445,2.6; 10 3.175,2.6; 11 1.905,2.6; 12 0.635,2.6; 13 -0.635,2.6; 14 -1.905,2.6; 15 -3.175,2.6; 16 -4.445,2.6
RJ45 = drill 0.889: 1 -4.445,6.35; 2 -3.175,8.89; 3 -1.905,6.35; 4 -0.635,8.89; 5 0.635,6.35; 6 1.905,8.89; 7 3.175,6.35; 8 4.445,8.89 | drill 1.575 pad 2.184: G3 -7.874,3.302; G4 8.001,3.302 | hole 3.251: -5.715,0; 5.715,0
W237-133 = drill 1.194 long: 1 -5.08,-0.635; 2 0,-0.635; 3 5.08,-0.635
W237-132 = drill 1.194 long: 1 -2.54,-0.635; 2 2.54,-0.635

### Placement (x,y rotation side)
C1  93.5,53 0 bottom
C2  93.5,59.01 0 bottom
C3  93.5,65 0 bottom
C4  89.5,45 270 bottom
C5  62.5,29.25 180 bottom
C6  62.5,38.75 180 bottom
C7  77.25,7.5 0 bottom
C8  69.75,9.5 0 bottom
C9  65,19 270 bottom
C10  88.5,37.75 270 bottom
C11  87.5,45 270 bottom
C12  77.25,5.5 0 bottom
C13  65.75,13.5 270 bottom
C14  63.5,15.5 270 bottom
C15  85.25,45 270 bottom
C16  91.5,45 270 bottom
C17  73,47.75 225 top
C18  79.5,10.25 90 bottom
C19  62.5,20.5 90 bottom
C20  30.5,47.25 90 bottom
C21  48.75,20 0 bottom
C22  10.5,59.75 90 bottom
C23  81.25,14 90 bottom
C24  86.5,37.75 270 bottom
C25  65.5,22.5 0 bottom
C26  66,31 90 bottom
C27  79.5,24 90 bottom
C28  83.75,13.25 270 bottom
C29  42.25,46.75 270 bottom
C30  44,44.75 90 bottom
C31  44.25,36.75 90 bottom
C32  31.75,31.75 270 bottom
C33  42.25,51 270 bottom
C34  47,36.25 90 bottom
C35  40,31.75 0 bottom
C36  20,3.25 90 bottom
C37  38.25,24.5 180 bottom
C38  20.5,22.75 270 bottom
C39  38.25,18 180 bottom
C40  20.75,18.75 90 bottom
C41  48,5.5 180 bottom
C42  45.25,3.75 90 bottom
C43  48.25,44.25 0 bottom
C44  48.25,42.25 0 bottom
C45  35,63.5 180 bottom
C46  8.5,55.5 90 bottom
C47  42,60.75 90 bottom
C48  16.75,56.25 270 bottom
C49  31.5,60.75 90 bottom
C50  8.5,59.75 90 bottom
C51  2.25,56.25 270 bottom
C52  48,25.25 180 bottom
C53  10.5,55.5 90 bottom
C54  16.25,44.5 90 bottom
C55  22.25,27.25 0 bottom
C56  21.25,13.75 0 bottom
C57  33.75,31.75 90 bottom
C58  28.5,47.25 270 bottom
C59  40,14.5 180 bottom
C60  33.25,17 270 bottom
C61  39,63.5 0 bottom
C62  2.25,60.5 270 bottom
C63  16.75,60.5 270 bottom
C64  54.5,25.75 0 bottom
C65  20,10.5 270 top
C66  19,57 90 top
C67  19,62.75 270 top
C69  82.25,6.75 180 bottom
D1  55.25,3 0 bottom
D2  59.5,21 90 bottom
H1  95,70 0 top
H2  95,5 0 top
H3  5,5 0 top
H4  5,70 0 top
IC1  91.5,63 90 top
IC2  73.49,17.25 0 bottom
IC3  37,60 270 bottom
IC4  61.75,34 0 bottom
IC5  36.25,40.5 270 bottom
IC6  15.75,58 270 top
IC7  7.5,58 270 top
JP1  81,4 0 top
JP2  83,22.75 90 top
JP3  34.5,54 180 top
JP4  24,50.25 270 top
JP5  15.25,10 270 top
JP6  10,49 0 top
JP7  20,50.25 90 top
JP8  35,27.5 180 top
JP9  16.5,3.5 90 top
JP10  43.75,40 0 top
L1  47,30.75 180 bottom
L2  64.25,43.25 180 bottom
LED1  63.75,3.25 270 top
LED2  27,70 90 top
LED3  59.25,3.25 270 top
LED4  68.25,3.25 270 top
LED5  31.5,70 90 top
LED6  22.5,70 90 top
LOGO1  40.5,69.75 0 top
LOGO2  40.5,69.75 0 bottom
Q1  76.5,6.5 90 top
Q2  47.5,43.25 90 top
R1  52.5,69.25 180 top
R2  53.25,54.75 90 bottom
R3  59.25,7 90 bottom
R4  68,26.25 90 bottom
R5  70.75,4.5 180 bottom
R6  87.5,22.75 270 bottom
R7  85.5,22.75 90 bottom
R9  55.25,54.75 90 bottom
R10  61.5,15.49 90 bottom
R11  91.5,19.25 90 bottom
R12  50,56.5 270 top
R13  65.5,5.25 90 bottom
R14  14.75,22.75 90 bottom
R15  17.75,23.75 0 bottom
R16  17.75,21.75 0 bottom
R17  18.75,27.25 180 bottom
R18  14.75,18.75 270 bottom
R19  33.75,22.5 180 bottom
R20  17.75,17.75 0 bottom
R21  38.25,22.5 180 bottom
R22  26.75,27 0 bottom
R23  87.25,16.5 180 bottom
R24  17.75,19.75 0 bottom
R25  19.25,15.75 180 bottom
R26  33.75,19.75 180 bottom
R27  38.25,20 180 bottom
R28  26.5,14.5 0 bottom
R29  45.25,7.25 270 bottom
R30  26.25,36.5 180 bottom
R31  32.5,3.75 90 bottom
R32  29.75,8 270 top
R33  14.5,33.25 90 bottom
R34  14.25,40.5 90 bottom
R35  24.25,58 270 bottom
R36  26.25,58 270 bottom
R37  22.25,58 270 bottom
R38  25.5,39.5 180 bottom
R39  7.5,16.25 270 bottom
R40  5.75,16.25 270 bottom
R41  18.5,44.5 270 bottom
R42  21.5,43.75 0 bottom
U$1  51.5,16 90 bottom
U$2  51.5,22.5 180 top
U$3  26.5,20.75 270 bottom
U$4  39,8 180 bottom
U$5  19.5,37.5 270 bottom
X1  3,18.25 270 top
X2  3,36.25 270 top
X3  83.5,70 180 top
X4  69.5,70 180 top
X6  15,70 180 top

### Tracks (layer width: path | path; a pad name or v marks a point on that pad's centre or on a via)
+3V3_DRV  (via drill 0.8 pad 1.5)
  Top 1: 69.75,21.25 v66.12,24.88 v64,27 | 72,23.5 v85.25,10.25 | 69.75,21.25 v61,12.75 v55.75,12.75 | v86,26 84,28 76.5,28 72,23.5 | 72,23.5 69.75,21.25
  Bottom 0.3: IC2.1 77.25,10.75 78.75,9.25 C18.1 81.25,9.25 83.38,11.38 | IC2.64 80.75,13.5 C23.1 82.62,13 C28.+ 83.75,11.75 83.38,11.38 | IC2.13 71.25,10.25 70.75,9.75 C8.1 70.75,8.25 69.75,7.25 68,7.25 66.75,8.5 63.25,8.5 62.5,9.25 62.5,14.5 | IC2.19 C13.1 C14.2 | 63.25,14.5 C14.2 | 62.5,14.5 61.55,14.5 R10.1 61.5,13 v61,12.75 | 62.5,14.5 C14.2 | IC2.48 C27.1 80.5,24 84.75,24 85.05,23.7 R7.2 86,24.2 v86,26 | R4.1 66.5,23.8 | 66.5,23.8 C25.1 66.75,22 66.75,21 IC2.32 | C26.1 63.76,30 IC4.1 63.66,29.47 C5.+ 63.88,27.12 v64,27 | v85.25,10.25 84,11.5 83.38,11.38 | 66.5,23.8 66.5,24.5 v66.12,24.88 | v55.75,12.75 55.75,14 54.67,14 U$1.8
+3V3_RES
  Bottom 0.3: C20.1 IC5.48 32.5,44.25 | IC5.32 32.5,34 31.75,33.25 C32.1 | 45.25,30.5 40.25,30.5 | 40.25,30.5 C35.2 IC5.19 39,36 38.75,36.25 32.5,36.25 IC5.32 | IC5.1 44,44.25 C30.1 | IC5.64 40,47.25 40.5,47.75 C29.1 | C29.1 C33.+ 43.5,50.88 43.5,57 | C61.1 40,62.05 IC3.1 41.78,61.91 | 41.78,61.91 C47.+ | IC5.1 44.75,44.25 45.25,44.75 45.25,46.75 44.75,47.25 42.75,47.25 C29.1 | 41.78,61.91 42.59,61.91 43.5,61 43.5,57 | 32.5,44.25 IC5.32 | JP3.9 29.52,55.27 31.25,57 43.5,57 | 32.5,44.25 IC5.1 | U$1.1 47.41,14.1 43.5,18 43.5,25.75 40.25,29 40.25,30.5 | 45.75,31 45.25,30.5 | 45.25,30.5 L1.1
+5V_RES  (via drill 0.8 pad 1.5)
  Top 1: v15,49 18,46 18,25.5 | 18,25.5 v18,13.75 v18,7.5 | v19.75,25.5 18,25.5
  Bottom 0.3: C53.1 12.25,54.5 | 12.25,54.5 IC6.3 16.16,55.46 C48.+ 18.14,54.88 C66.+ 19,56.25 20.75,58 27.38,58 C49.+ 32.22,61.91 IC3.8 34.4,63.4 C45.1 | R25.2 20.2,13.75 | C56.2 20.2,13.55 20.2,13.75 | 12.25,54.5 12.25,49.29 JP6.3 v15,49 15,43.75 15.25,43.5 C54.1 16.25,42 16.3,41.95 U$5.16 | U$5.4 22.23,38 25.75,38 26.25,37.5 26.25,32.25 C55.2 19.8,27.25 19.75,27.2 | R17.2 19.75,27.2 | 19.75,27.2 v19.75,25.5 | JP5.3 16.5,7.46 | 16.5,7.46 17.96,7.46 v18,7.5 | 20.02,2.23 JP9.1 16.5,3.5 16.5,7.46 | 27.21,4.75 23.75,4.75 21.23,2.23 20.02,2.23 | 20.02,2.23 C36.1 | 20.2,13.75 v18,13.75 | R32.E 27.21,4.75 | 27.21,4.75 32,4.75 32,4.7 R31.2
+12V_RES  (via drill 0.8 pad 1.5)
  Top 1: v7.5,46.25 13,46.25 15,44.25 v15,15.5
  Bottom 0.3: C51.+ 2.83,55.46 IC7.3 5.92,54.5 C46.1 8.5,51 7.5,50 JP6.1 7.46,46.04 v7.5,46.25 | 33.75,18 33.75,20.75 33.13,21.37 U$3.4 | 33.75,18 C60.1 | 33.75,18 34.75,18 36.5,16.25 | 36.5,16.25 38.5,14.25 | C59.1 38.5,14.25 | 36.5,16.25 32.75,12.5 20,12.5 | v15,15.5 15,12.79 JP5.1 15.25,12.5 20,12.5 | C65.+ 20,12.5 | 38.5,14.25 38.38,14.13 U$4.4
+15V_DRV  (via drill 0.8 pad 1.5)
  Top 1: v56,28.25 v56,39 91.55,39 IC1.14
  Bottom 0.3: 91.53,39.03 IC1.14 91.3,38.75 C10.1 C24.1 | IC4.8 63.66,38.53 C6.+ 62.62,40 59.75,40 58.75,39 v56,39 | U$2.4 55.31,25.75 | C64.1 55.31,25.75 | 55.31,25.75 55.31,27.56 v56,28.25
+24V_RES  (via drill 0.8 pad 1.5)
  Top 1: v22,64 35,64 43.25,55.75 43.25,45 41.75,43.5 41.75,39 44.75,36 48.25,36 49.25,35 v49.25,28.25
  Bottom 0.3: 7.92,60.54 C50.+ | 11.09,60.54 C22.+ | v49.25,28.25 49.25,28 49.5,27.75 49.5,24.88 C52.+ 50.12,24.5 50.12,22.5 | 50.12,22.5 50.12,20.62 C21.1 | U$2.2 50.12,22.5 | C67.+ 19.25,64
  Bottom 1: 7.92,60.54 IC7.1 4,61.5 C62.1 | 11.09,60.54 IC6.1 14.17,61.5 C63.1 17.54,62.29 17.54,64 | X6.1 17.54,64 | C22.+ C50.+ | v22,64 19.25,64 17.54,64
AMP
  Bottom 0.3: R11.1 91.5,11.25 82,1.75 70,1.75 68.75,3.25 57.5,3.25 | IC2.24 66.5,17 66,16.5 C14.1 63.2,16.45 R10.2 61.45,16.5 60.75,16.5 59.75,15.5 59.75,10.5 57.5,8.25 57.5,3.25 | 57.5,3.25 57.5,3 D1.C
CAN_RX/I2C_SCK
  Bottom 0.3: JP3.3 37.04,55.21 38.25,54 38.25,50.5 38.5,50.25 IC5.61
CAN_TX/I2C_SDA
  Bottom 0.3: JP3.1 39.58,55.17 40.75,54 40.75,52 39,50.25 IC5.62
COS
  Bottom 0.3: R27.1 37.25,20 | 37.25,20 C39.1 | 37.25,20 34.95,20 R26.2 34.5,20.2 34.5,20.75 33.75,21.5 33.75,27.48 JP8.3 36,29.77 IC5.25
E
  Bottom 0.3: IC2.58 86.04,16.5 R23.1 85.55,17.25 85.5,17.3 R7.1
  Bottom 0.406: R6.2 R7.1
EN
  Bottom 0.3: IC1.21 90.03,25.03 89.2,24.2 89.2,17.75 R23.2 88,16.45 88,16 87.25,15.25 85.5,15.25 84.75,16 IC2.59
G
  Bottom 0.3: R3.2 59.8,7.75 66.5,7.75 67.75,6.5 71.5,6.5 72.74,7.74 IC2.10
G_RES
  Bottom 0.3: IC5.53 34.5,48.5 32,51 28.25,51 27.5,51.75 27.5,55.25 25.75,57 R36.2
GND_DRV  (via drill 0.8 pad 1.5)
  other vias: 61,27 53.5,28.25 83,18 57,59 67.5,11.5 70,28 86,14 94,21 81.25,11.25 55.75,5.5
  pour Bottom: 46.25,75 63.99,75 64,40.5 100,40.5 100,0 52.25,0 52.25,47.75 46.25,53.76
  pour Top: 46.25,75 63.99,74.75 64,40.5 99.75,40.5 99.83,40.43 100.01,0 52.25,0 52.25,47.75 46.25,53.76
  pour Bottom (no thermals): 60.5,38 63,38 63,30 60.5,30
GND_RES  (via drill 0.8 pad 1.5)
  other vias: 30.25,34.5 46.75,28.25 40.5,49.5 37,66 12.5,64.5 42.75,14.5 31,14 25,8 22,31.5 8.5,27.25 47.75,8 26,49 47,32.75 24,11.25 29.5,58 17,50.25 11,5 49.5,37.5
  pour Bottom: 0,0 0,75 44.75,75 44.75,53.25 50.75,47.25 50.75,0
  pour Top: 0,0 0,75 44.75,75 44.75,53.25 50.75,47.25 50.75,0
  pour Bottom (no thermals): 32.75,61.25 43,61.25 43,58.75 32.75,58.75
ITRIP
  Bottom 0.3: R11.2 91.55,23 IC1.22
MISO
  Bottom 0.3: JP3.7 31.96,55.04 33.25,53.75 33.25,51.75 36,49 IC5.56
MOSI
  Bottom 0.3: JP3.6 34.5,51.25 36.5,49.25 IC5.57
N$1
  Bottom 1.25: IC1.7 96.55,53 C1.1
N$2
  Bottom 0.5: R12.P$1 50,69.21 R1.P$2
N$3
  Bottom 1.25: IC1.4 96.55,59.01 C2.1
N$4
  Bottom 0.3: LED2.A 24.75,66.45 24.75,60.25 24.25,59.75 R35.1
N$5
  Bottom 1.25: IC1.1 96.55,65 C3.1
N$6
  Bottom 0.3: R32.S 34.75,8 37.11,5.64 U$4.14
N$8
  Bottom 0.3: R3.1 LED3.A
N$9
  Bottom 0.3: R5.1 68.27,4.5 LED4.A
N$10
  Bottom 0.3: C7.2 76.5,7.7 Q1.2 75.71,9.04 75.24,9.51 IC2.5
N$11
  Bottom 0.3: LED5.A 26.25,63.45 R36.1
N$12
  Bottom 0.3: Q1.1 76.5,5.3 C12.2 76,5.5 74.74,6.76 IC2.6
N$13
  Bottom 0.3: C58.2 28.5,45 29.75,43.75 IC5.47
N$14
  Bottom 0.3: IC5.31 33,34 33.75,33.25 C57.2
N$15
  Bottom 0.3: IC5.6 47.46,41.75 | 47.46,41.75 Q2.1 | C44.2 47.3,42.09 47.46,41.75
N$16
  Bottom 0.3: X1.7 12.93,15.07 13.25,14.75 13.25,10.5 13.75,10 JP5.2
N$17
  Bottom 0.3: R39.2 7.5,12.5 JP9.4
N$18
  Bottom 0.3: R22.1 27.7,23.8 28.86,22.64 U$3.3 32.66,22.64 R19.1 32.8,22.58
N$19
  Bottom 0.3: R17.1 17.75,26.8 17.75,22.75 18.5,22.25 18.5,21.75 R16.1 C38.2 20.94,21.31 21,21.37 U$3.13
N$20
  Bottom 0.3: R37.1 22.25,60 23.75,61.5 23.75,67.48 LED6.A
N$21
  Bottom 0.3: R40.2 5.45,15.3 5.75,15 6.25,14.75 6.25,12.75 13.25,5.75 13.25,3.25 14.25,2.25 15.21,2.25 JP9.2
N$24
  Bottom 0.3: R25.1 18.3,15.95 17.75,15.95 17.75,18.75 18.5,19.25 18.5,19.75 R24.1 C40.2 21.1,20.1 U$3.12
N$25
  Bottom 0.3: X2.7 8.75,33.08 7.5,34.33 7.5,42.25 10,44.75 JP6.2
N$26
  Bottom 0.3: R28.1 27.45,18.51 29.04,20.1 U$3.5 32.74,20.1 32.8,20.04 R26.1
N$27
  Bottom 0.3: X1.4 6.63,18.89 5.75,18 R40.1
N$28
  Bottom 0.3: R20.1 C40.1 21.83,18.83 U$3.11 24.17,18.83 25.5,17.5 25.5,14.55 R28.2
N$29
  Bottom 0.3: U$5.15 15.03,40.67 R34.2 9.86,41.45 X2.1
N$30
  Bottom 0.3: C42.2 45.25,5.5 | 45.25,5.5 R29.2 | C41.1 45.25,5.5
N$31
  Bottom 0.3: R31.1 32.75,2.75 32.75,2.5 38.5,2.5 | 38.5,2.5 45,2.5 C42.1 | 38.5,2.5 38.38,2.62 U$4.13
N$32
  Bottom 0.3: R15.1 C38.1 21.61,22.64 U$3.14 24.41,22.64 25.8,24.03 R22.2
N$33
  Bottom 0.3: 37.1,11.99 U$4.3 37.11,10.36 36.75,10 33.5,10 33,10.5 27.21,10.5 R32.A 26.92,10.5 26,10.5 25.25,9.75 22.75,9.75 JP9.3
N$34
  Bottom 0.3: X1.5 6.92,17.61 R39.1
N$35
  Bottom 0.3: U$5.5 24.68,36.87 R30.1
N$36
  Bottom 0.3: U$5.14 14.36,39.41 R34.1 12.02,39.55 X2.2
N$37
  Bottom 0.3: U$5.10 14.62,34.33 R33.2 14.05,34.45 13,35.5 11.5,35.5 9.5,37.5 9.5,38.01 X2.3
N$38
  Bottom 0.3: U$5.9 15.26,33.05 R33.1 13.69,32.55 X2.6
N$39
  Bottom 0.3: IC5.5 46,42.25 46.25,42.5 46.25,43.45 C43.2 47.3,46.09 Q2.2
N$40
  Bottom 0.3: U$5.1 20.45,41.95 19.5,41 19.5,31.75 17.75,30 13.5,30 4,20.5 4,16.75 4.5,16.25 11.79,16.25 X1.6 13.29,16.34 R18.2 16.75,17.8 R20.2
N$41
  Bottom 0.3: U$5.7 23.93,34.33 24.5,33.75 24.5,32 21.5,29 14,29 8.25,23.25 8.25,22.25 9,21.5 11.81,21.5 X1.2 14.38,21.43 R14.1 16.75,21.8 R16.2
N$42
  Bottom 0.3: R42.2 20.5,42.75 19,41.25 19,36.75 18,35.75 17.05,35.75 U$5.11
N$43
  Bottom 0.3: R13.1 64.05,4.32 LED1.A
N$44
  Bottom 0.3: R41.2 18.25,43.25 18.5,43 18.5,38.75 18,38.25 17.02,38.25 U$5.13
N$45
  Bottom 0.3: R38.1 22.2,39.5 U$5.3
N$46
  Bottom 0.3: C31.2 44.74,38.06 | 46.38,38.25 C34.+ 47.07,38.06 | L1.2 47.95,31.7 48.75,32.5 48.75,36.38 47.07,38.06 | IC5.13 44.55,38.25 44.74,38.06 | 44.74,38.06 47.07,38.06
N$47
  Bottom 0.3: R15.2 16.75,23.7 R14.2 14.7,23.75 11.75,23.75 10.7,22.7 X1.1 9.5,22.84 9.5,23.75 14.25,28.5 21.75,28.5 25.25,32 25.25,34 23.66,35.59 U$5.6
N$50
  Bottom 0.3: U$5.2 20.68,40.67 20,40 20,31.5 18,29.5 13.75,29.5 7.5,23.25 7.5,20.75 8,20.25 9.26,20.25 X1.3 14.29,20.16 R18.1 16.75,19.7 R24.2
NRST_RES
  Bottom 0.3: IC5.7 43.25,41.25 43.75,40.75 JP10.1
R
  Bottom 0.3: IC2.8 73.74,6.54 R5.2
R_RES
  Bottom 0.3: IC5.51 33.5,48 31.5,50 27.75,50 26.5,51.25 26.5,54.25 25.5,55.25 22.5,55.25 22.25,55.5 R37.2
RES
  Bottom 0.3: R29.1 45.25,14.5 41.75,18 41.75,24.56 JP8.1 38,28.31 IC5.21
RST
  Bottom 0.3: IC2.7 74.24,3.26 74.75,2.75 80.75,2.75 81,3 JP1.1 81,6.75 C69.1
RX  (via drill 0.8 pad 1.5)
  Top 1: v63.75,11.5 62.75,10.5 v55.75,10.5
  Bottom 0.3: IC2.17 64.75,13.5 63.75,12.5 v63.75,11.5 | v55.75,10.5 57.25,12 57.25,14.25 56.25,15.25 54.69,15.25 U$1.7
RX1_RES
  Bottom 0.3: JP3.4 37.04,50.21 37.5,49.75 IC5.59
RX2_RES  (via drill 0.8 pad 1.5)
  Top 1: v44.5,27.75 v44.5,33.5
  Bottom 0.3: U$1.3 46.87,16.64 44.5,19 v44.5,27.75 | IC5.17 40,33.5 v44.5,33.5
SCK
  Bottom 0.3: JP3.8 31.96,52.29 35.5,48.75 IC5.55
SIN
  Bottom 0.3: 34.75,22.55 R19.2 R21.1 37.3,24.5 C37.1 36.27,25.48 JP8.2 36.5,27.73 36.5,27.75 36.5,29 IC5.24
SWCLK
  Bottom 0.3: JP2.1 82.02,20.21 81.25,20.23 80.5,21 IC2.49
SWCLK_RES
  Bottom 0.3: IC5.49 32.5,48.25 31.25,49.5 27.5,49.5 24.21,52.79 JP4.1
SWDIO
  Bottom 0.3: IC2.46 76.24,24.99 77.25,26 80.75,26 81.5,25.25 82.71,25.25 JP2.3
SWDIO_RES
  Bottom 0.3: IC5.46 28,43.25 24,47.25 JP4.3
TIM1_1
  Bottom 0.3: IC1.18 79.28,31.03 73.74,25.49 IC2.41
TIM1_1N
  Bottom 0.3: IC1.15 96.55,37 94.5,37 93.75,36.25 90.5,36.25 89.75,35.5 80.25,35.5 70.25,25.5 IC2.34
TIM1_2
  Bottom 0.3: IC1.19 78.03,29.03 74.24,25.24 IC2.42
TIM1_2N
  Bottom 0.3: IC2.35 70.75,25.25 80.5,35 91.55,35 IC1.16
TIM1_3
  Bottom 0.3: IC2.43 74.74,24.99 77.03,27.28 91.33,27.28 IC1.20
TIM1_3N
  Bottom 0.3: IC1.17 79.28,33.03 71.25,25 IC2.36
TIM1_A
  Bottom 0.3: IC5.42 27.5,41.25 23.5,45.25 18.7,45.25 R41.1
TIM1_B
  Bottom 0.3: R42.1 23,43.75 26,40.75 IC5.41
TIM3_A
  Bottom 0.3: R38.2 29.25,39.5 29.5,39.25 IC5.38
TIM3_B
  Bottom 0.3: IC5.37 29.25,38.75 27.75,37.25 27.75,37.05 R30.2
TX  (via drill 0.8 pad 1.5)
  Top 1: v66.5,9.75 65,8.25 v55.75,8.25
  Bottom 0.3: v66.5,9.75 68.25,8 69.25,8 69.74,8.49 IC2.16 | v55.75,8.25 58.25,10.75 58.25,14.75 56.5,16.5 54.94,16.5 U$1.6
TX1_RES
  Bottom 0.3: JP3.5 34.5,55 35.75,53.75 35.75,50.75 37,49.5 IC5.58
TX2_RES  (via drill 0.8 pad 1.5)
  Top 1: v42.25,35.25 v42.25,29.25
  Bottom 0.3: IC5.16 42,35.5 v42.25,35.25 | U$1.2 48.31,15.25 47.25,15.25 44,18.5 44,26 42.25,27.75 v42.25,29.25
U
  Bottom 0.5: C1.2 92,51.45 IC1.8
  pour Bottom (no thermals): 77,72 77.5,72.5 79.5,72.5 80,72 80,64.25 93,51.25 93,50.5 90.75,50.5 77,64.25
USB_DM
  Bottom 0.3: IC5.44 27.25,42.25 23.75,45.75 22.25,45.75 20.25,47.75 19.04,47.75 JP7.1
USB_DP
  Bottom 0.3: IC5.45 27.5,42.75 24,46.25 22.75,46.25 22,47 22,50.75 20,52.75 19.04,52.75 JP7.3
V
  Bottom 1: C2.2 92.25,58.75 91.58,58.08 IC1.5
  pour Bottom (no thermals): 82,72 82.5,72.5 84.5,72.5 85,72 85,65.25 93,57.25 93,56.5 90.75,56.5 82,65.25
V+
  Bottom 0.3: 71,72 72,70.67 X4.1
  Bottom 0.5: IC1.10 | 71,72 69.25,73.75 59.54,73.75 R1.P$1
  pour Bottom (no thermals): 70.5,72 70.5,51.75 76.25,46 97.5,46 98,46.5 98,48 97.5,48.5 89.75,48.5 74,64.25 74,72 73.5,72.5 71,72.5
V-  (via drill 0.8 pad 1.5)
  other vias: 65.25,64.75
  pour Bottom (no thermals): 65,72 65.5,72.5 67.75,72.5 68.5,71.75 68.5,50.75 75.25,44 92.5,44 93,43.5 93,42 92.5,41.5 65,41.5
  pour Top: 64.5,75 64.5,41 100,41 100,75
VLT
  Bottom 0.3: IC2.25 65.5,17.5 C9.2 60,18 59,19 59,19.3 | 53.24,53.96 R2.1 | 54.5,53.8 R9.1 | 54.25,53.8 54.25,33.75 58,30 58,20 58.7,19.3 59,19.3 | 59,19.3 D2.C
  Bottom 0.5: R12.P$2 53.24,53.96 | R2.1 54.25,53.8 54.5,53.8
VTH
  Bottom 0.3: 67.12,28.12 76.75,37.75 93.25,37.75 96.53,41.03 IC1.13 | 67.12,28.12 61,22 61,19.5 C19.1 63,19 66,19 67,18 IC2.26 | R4.2 68,27.25 67.12,28.12
W
  Bottom 1: C3.2 91.58,64.07 IC1.2
  pour Bottom (no thermals): 87,72 87.5,72.5 89.5,72.5 90,72 90,66.25 93,63.25 93,62.5 90.75,62.5 87,66.25
Y
  Bottom 0.3: IC2.9 73.24,7.24 72,6 65.69,6 R13.2
Y_RES
  Bottom 0.3: R35.2 25.25,56 25.75,56 27,54.75 27,51.5 28,50.5 31.75,50.5 34,48.25 IC5.52